# Altium project PWM_IO.PrjPcb
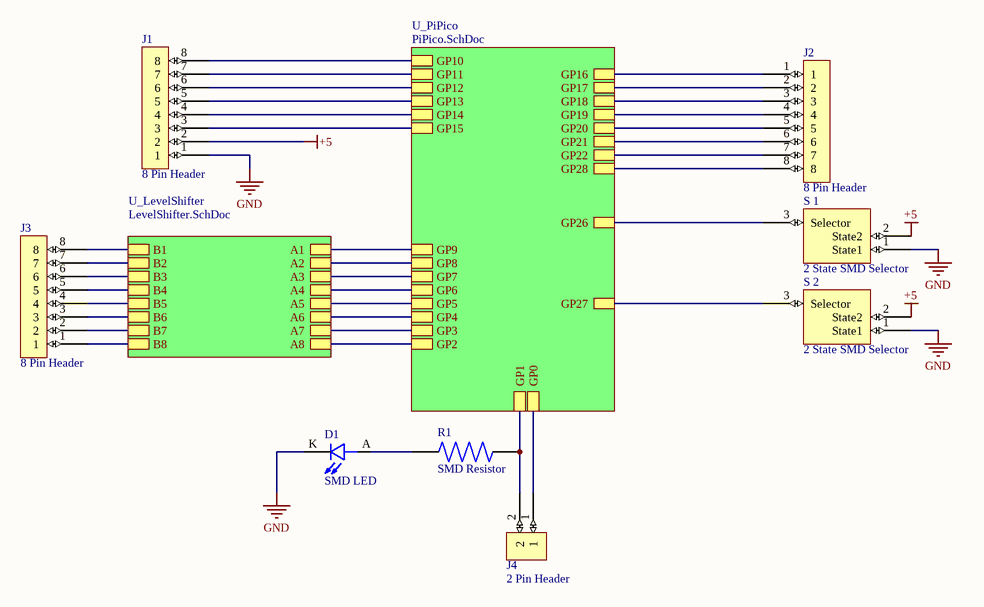
[diagram p0: TopLevel.SchDoc]
3 sheets, 16 parts. Net scope: hierarchical (ports join the sheet entries above them; power ports are global).
Board files: PWm_IO.PcbDoc, PWM Header Board.PcbDoc
Sheets:
  TopLevel.SchDoc
    U_PiPico = PiPico.SchDoc
    U_LevelShifter = LevelShifter.SchDoc

## Sheet TopLevel.SchDoc
size A4; SheetNumber: 1; SheetTotal: 3

### Parts
D1  SMD LED  [SMD LED-Footprint-1]
J1  8 Pin Header  [8 Pin Header-Footprint-1]
J2  8 Pin Header  [8 Pin Header-Footprint-1]
J3  8 Pin Header  [8 Pin Header-Footprint-1]
J4  2 Pin Header  [2 Pin Header-Footprint-1]
R1  SMD Resistor  [SMD Resistor-Footprint-1]
S_1  2 State SMD Selector  [2 State SMD Selector-Footprint-1]
S_2  2 State SMD Selector  [2 State SMD Selector-Footprint-1]

### Sub-sheets
U_LevelShifter = LevelShifter.SchDoc: A1, A2, A3, A4, B1, B2, B3, B4, A5, A6, A7, A8, B5, B6, B7, B8
U_PiPico = PiPico.SchDoc: GP0, GP1, GP2, GP3, GP4, GP5, GP6, GP7, GP8, GP9, GP10, GP11, GP12, GP13, GP14, GP15, GP16, GP17, GP18, GP19, GP20, GP21, GP22, GP26, GP27, GP28

### Nets
+5: J1.2 S_1.2(State2) S_2.2(State2)
GND: D1.K(C) J1.1 S_1.1(State1) S_2.1(State1)
NetD1_A: D1.A R1.1
NetI1_1: sheet U_PiPico/GP9, sheet U_LevelShifter/A1
NetI1_3: sheet U_PiPico/GP8, sheet U_LevelShifter/A2
NetI1_4: sheet U_PiPico/GP7, sheet U_LevelShifter/A3
NetI1_5: sheet U_PiPico/GP6, sheet U_LevelShifter/A4
NetI1_6: sheet U_PiPico/GP5, sheet U_LevelShifter/A5
NetI1_7: sheet U_PiPico/GP4, sheet U_LevelShifter/A6
NetI1_8: sheet U_PiPico/GP3, sheet U_LevelShifter/A7
NetI1_9: sheet U_PiPico/GP2, sheet U_LevelShifter/A8
NetI1_12: J3.1 ; sheet U_LevelShifter/B8
NetI1_13: J3.2 ; sheet U_LevelShifter/B7
NetI1_14: J3.3 ; sheet U_LevelShifter/B6
NetI1_15: J3.4 ; sheet U_LevelShifter/B5
NetI1_16: J3.5 ; sheet U_LevelShifter/B4
NetI1_17: J3.6 ; sheet U_LevelShifter/B3
NetI1_18: J3.7 ; sheet U_LevelShifter/B2
NetI1_20: J3.8 ; sheet U_LevelShifter/B1
NetJ1_3: J1.3 ; sheet U_PiPico/GP15
NetJ1_4: J1.4 ; sheet U_PiPico/GP14
NetJ1_5: J1.5 ; sheet U_PiPico/GP13
NetJ1_6: J1.6 ; sheet U_PiPico/GP12
NetJ1_7: J1.7 ; sheet U_PiPico/GP11
NetJ1_8: J1.8 ; sheet U_PiPico/GP10
NetJ2_1: J2.1 ; sheet U_PiPico/GP16
NetJ2_2: J2.2 ; sheet U_PiPico/GP17
NetJ2_3: J2.3 ; sheet U_PiPico/GP18
NetJ2_4: J2.4 ; sheet U_PiPico/GP19
NetJ2_5: J2.5 ; sheet U_PiPico/GP20
NetJ2_6: J2.6 ; sheet U_PiPico/GP21
NetJ2_7: J2.7 ; sheet U_PiPico/GP22
NetJ2_8: J2.8 ; sheet U_PiPico/GP28
NetJ4_1: J4.1 ; sheet U_PiPico/GP0
NetJ4_2: J4.2 R1.2 ; sheet U_PiPico/GP1
NetM1_31: S_1.3(Selector) ; sheet U_PiPico/GP26
NetM1_32: S_2.3(Selector) ; sheet U_PiPico/GP27

### Library data of the parts
D1 = CMP-00018-3: Generic SMD LED
J1-J3 = CMP-00039-1: 8 Pin Breakout Header
J4 = CMP-00041-1: 2Pin  Breakout Header
R1 = CMP-00019-2: Generic SMD Resistor
S_1 S_2 = CMP-00040-1: This is a SMD Pin Soldering Selector

## Sheet PiPico.SchDoc
size A4; SheetNumber: 2; SheetTotal: 3
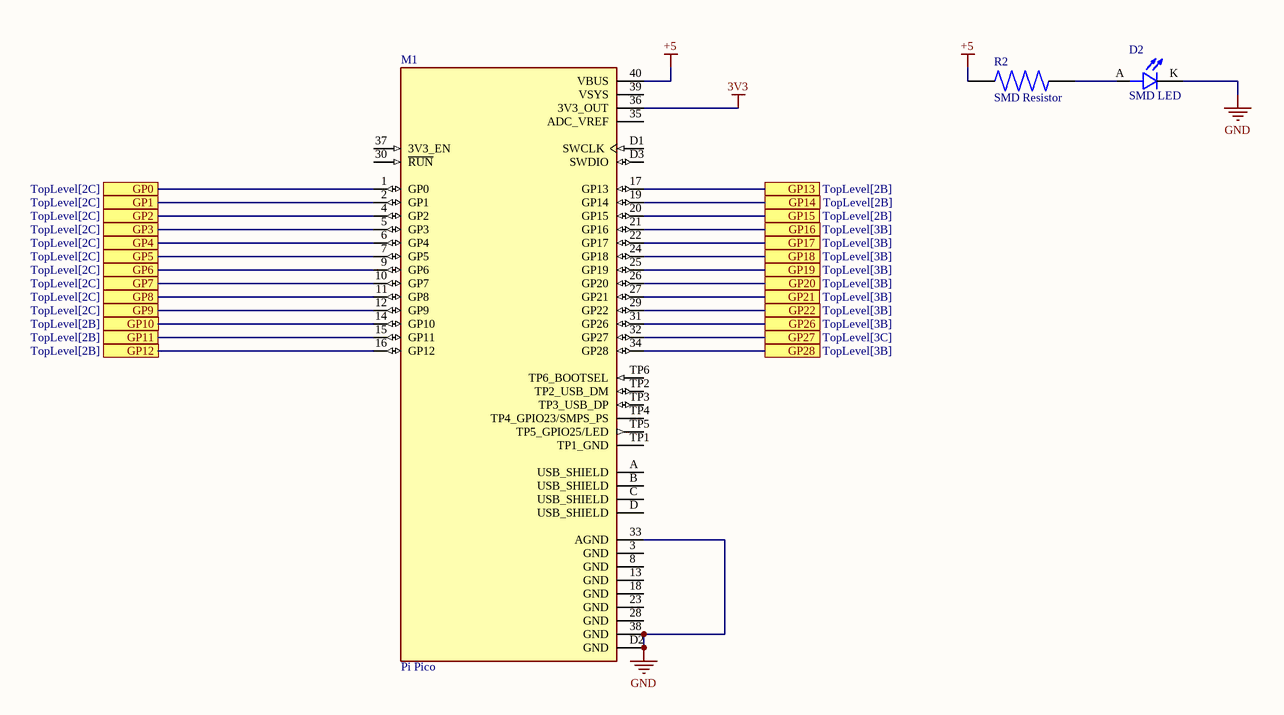
[diagram p1: PiPico.SchDoc]

### Parts
D2  SMD LED  [SMD LED-Footprint-1]
M1  Pi Pico  [Pi Pico-Footprint-1]
R2  SMD Resistor  [SMD Resistor-Footprint-1]

### Ports
GP0 (see TopLevel[2C]), GP1 (see TopLevel[2C]), GP2 (see TopLevel[2C]), GP3 (see TopLevel[2C]), GP4 (see TopLevel[2C]), GP5 (see TopLevel[2C]), GP6 (see TopLevel[2C]), GP7 (see TopLevel[2C]), GP8 (see TopLevel[2C]), GP9 (see TopLevel[2C]), GP10 (see TopLevel[2B]), GP11 (see TopLevel[2B]), GP12 (see TopLevel[2B]), GP13 (see TopLevel[2B]), GP14 (see TopLevel[2B]), GP15 (see TopLevel[2B]), GP16 (see TopLevel[3B]), GP17 (see TopLevel[3B]), GP18 (see TopLevel[3B]), GP19 (see TopLevel[3B]), GP20 (see TopLevel[3B]), GP21 (see TopLevel[3B]), GP22 (see TopLevel[3B]), GP26 (see TopLevel[3B]), GP27 (see TopLevel[3C]), GP28 (see TopLevel[3B])

### Nets
3V3: M1.36(3V3_OUT)
+5: M1.40(VBUS) R2.1
GND: D2.K(C) M1.33(AGND) M1.38(GND) M1.D2(GND)
NetD2_A: D2.A R2.2
NetI1_1: M1.12(GP9) ; port GP9
NetI1_3: M1.11(GP8) ; port GP8
NetI1_4: M1.10(GP7) ; port GP7
NetI1_5: M1.9(GP6) ; port GP6
NetI1_6: M1.7(GP5) ; port GP5
NetI1_7: M1.6(GP4) ; port GP4
NetI1_8: M1.5(GP3) ; port GP3
NetI1_9: M1.4(GP2) ; port GP2
NetJ1_3: M1.20(GP15) ; port GP15
NetJ1_4: M1.19(GP14) ; port GP14
NetJ1_5: M1.17(GP13) ; port GP13
NetJ1_6: M1.16(GP12) ; port GP12
NetJ1_7: M1.15(GP11) ; port GP11
NetJ1_8: M1.14(GP10) ; port GP10
NetJ2_1: M1.21(GP16) ; port GP16
NetJ2_2: M1.22(GP17) ; port GP17
NetJ2_3: M1.24(GP18) ; port GP18
NetJ2_4: M1.25(GP19) ; port GP19
NetJ2_5: M1.26(GP20) ; port GP20
NetJ2_6: M1.27(GP21) ; port GP21
NetJ2_7: M1.29(GP22) ; port GP22
NetJ2_8: M1.34(GP28) ; port GP28
NetJ4_1: M1.1(GP0) ; port GP0
NetJ4_2: M1.2(GP1) ; port GP1
NetM1_31: M1.31(GP26) ; port GP26
NetM1_32: M1.32(GP27) ; port GP27

Not connected (* = marked no-connect by the designer): M1 3(GND) 8(GND) 13(GND) 18(GND) 23(GND) 28(GND) 30(~{RUN}) 35(ADC_VREF) 37(3V3_EN) 39(VSYS) A(USB_SHIELD) B(USB_SHIELD) C(USB_SHIELD) D(USB_SHIELD) D1(SWCLK) D3(SWDIO) TP1(TP1_GND) TP2(TP2_USB_DM) TP3(TP3_USB_DP) TP4(TP4_GPIO23/SMPS_PS) TP5(TP5_GPIO25/LED) TP6(TP6_BOOTSEL)

### Library data of the parts
D2 = CMP-00018-3: Generic SMD LED
M1 = CMP-00035-2
R2 = CMP-00019-2: Generic SMD Resistor

## Sheet LevelShifter.SchDoc
size A4; SheetNumber: 3; SheetTotal: 3
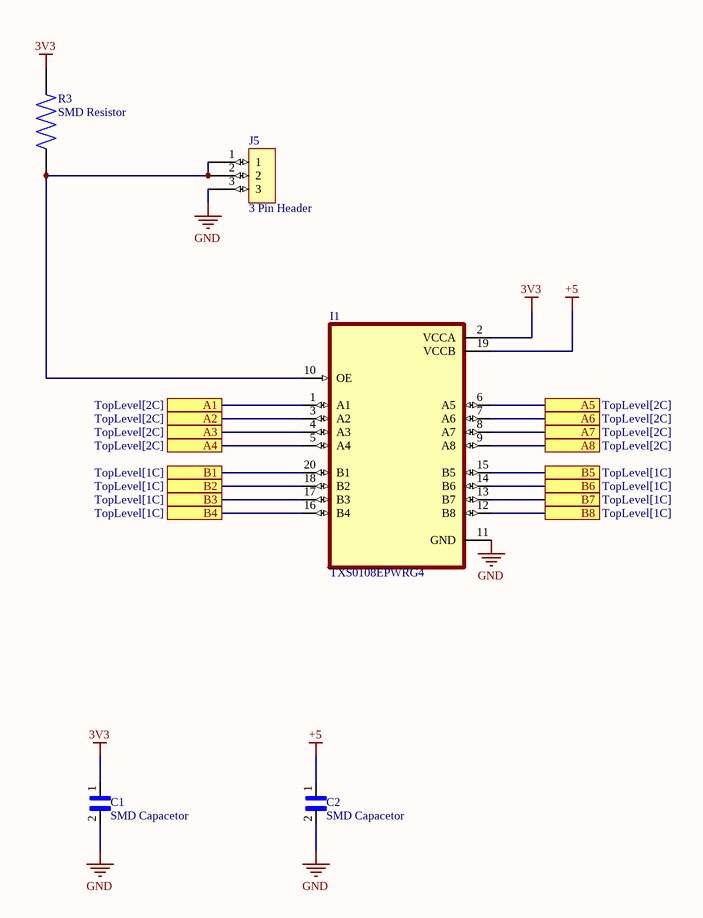
[diagram p2: LevelShifter.SchDoc]

### Parts
C1  SMD Capacetor  [SMD Capacetor-Footprint-1]
C2  SMD Capacetor  [SMD Capacetor-Footprint-1]
I1  TXS0108EPWRG4  [TXS0108EPWRG4-Footprint-1]
J5  3 Pin Header  [3 Pin Header-Footprint-1]
R3  SMD Resistor  [SMD Resistor-Footprint-1]

### Ports
A1 (see TopLevel[2C]), A2 (see TopLevel[2C]), A3 (see TopLevel[2C]), A4 (see TopLevel[2C]), A5 (see TopLevel[2C]), A6 (see TopLevel[2C]), A7 (see TopLevel[2C]), A8 (see TopLevel[2C]), B1 (see TopLevel[1C]), B2 (see TopLevel[1C]), B3 (see TopLevel[1C]), B4 (see TopLevel[1C]), B5 (see TopLevel[1C]), B6 (see TopLevel[1C]), B7 (see TopLevel[1C]), B8 (see TopLevel[1C])

### Nets
3V3: C1.1 I1.2(VCCA) R3.1
+5: C2.1 I1.19(VCCB)
GND: C1.2 C2.2 I1.11(GND) J5.3
NetI1_1: I1.1(A1) ; port A1
NetI1_3: I1.3(A2) ; port A2
NetI1_4: I1.4(A3) ; port A3
NetI1_5: I1.5(A4) ; port A4
NetI1_6: I1.6(A5) ; port A5
NetI1_7: I1.7(A6) ; port A6
NetI1_8: I1.8(A7) ; port A7
NetI1_9: I1.9(A8) ; port A8
NetI1_10: I1.10(OE) J5.1 J5.2 R3.2
NetI1_12: I1.12(B8) ; port B8
NetI1_13: I1.13(B7) ; port B7
NetI1_14: I1.14(B6) ; port B6
NetI1_15: I1.15(B5) ; port B5
NetI1_16: I1.16(B4) ; port B4
NetI1_17: I1.17(B3) ; port B3
NetI1_18: I1.18(B2) ; port B2
NetI1_20: I1.20(B1) ; port B1

### Library data of the parts
C1 C2 = CMP-00017-2: Generic SMD Capacetor
I1 = CMP-00042-2: 8-bit bidirectional voltage-level shifter
J5 = CMP-00043-1: 3 Pin Breakout Header
R3 = CMP-00019-2: Generic SMD Resistor

## Nets that join several sheets
3V3: PiPico (M1.36), LevelShifter (C1.1 I1.2 R3.1)
+5: TopLevel (J1.2 S_1.2 S_2.2), PiPico (M1.40 R2.1), LevelShifter (C2.1 I1.19)
GND: TopLevel (D1.K J1.1 S_1.1 S_2.1), PiPico (D2.K M1.33 M1.38 M1.D2), LevelShifter (C1.2 C2.2 I1.11 J5.3)
NetI1_1: PiPico (M1.12), LevelShifter (I1.1)
NetI1_3: PiPico (M1.11), LevelShifter (I1.3)
NetI1_4: PiPico (M1.10), LevelShifter (I1.4)
NetI1_5: PiPico (M1.9), LevelShifter (I1.5)
NetI1_6: PiPico (M1.7), LevelShifter (I1.6)
NetI1_7: PiPico (M1.6), LevelShifter (I1.7)
NetI1_8: PiPico (M1.5), LevelShifter (I1.8)
NetI1_9: PiPico (M1.4), LevelShifter (I1.9)
NetI1_12: TopLevel (J3.1), LevelShifter (I1.12)
NetI1_13: TopLevel (J3.2), LevelShifter (I1.13)
NetI1_14: TopLevel (J3.3), LevelShifter (I1.14)
NetI1_15: TopLevel (J3.4), LevelShifter (I1.15)
NetI1_16: TopLevel (J3.5), LevelShifter (I1.16)
NetI1_17: TopLevel (J3.6), LevelShifter (I1.17)
NetI1_18: TopLevel (J3.7), LevelShifter (I1.18)
NetI1_20: TopLevel (J3.8), LevelShifter (I1.20)
NetJ1_3: TopLevel (J1.3), PiPico (M1.20)
NetJ1_4: TopLevel (J1.4), PiPico (M1.19)
NetJ1_5: TopLevel (J1.5), PiPico (M1.17)
NetJ1_6: TopLevel (J1.6), PiPico (M1.16)
NetJ1_7: TopLevel (J1.7), PiPico (M1.15)
NetJ1_8: TopLevel (J1.8), PiPico (M1.14)
NetJ2_1: TopLevel (J2.1), PiPico (M1.21)
NetJ2_2: TopLevel (J2.2), PiPico (M1.22)
NetJ2_3: TopLevel (J2.3), PiPico (M1.24)
NetJ2_4: TopLevel (J2.4), PiPico (M1.25)
NetJ2_5: TopLevel (J2.5), PiPico (M1.26)
NetJ2_6: TopLevel (J2.6), PiPico (M1.27)
NetJ2_7: TopLevel (J2.7), PiPico (M1.29)
NetJ2_8: TopLevel (J2.8), PiPico (M1.34)
NetJ4_1: TopLevel (J4.1), PiPico (M1.1)
NetJ4_2: TopLevel (J4.2 R1.2), PiPico (M1.2)
NetM1_31: TopLevel (S_1.3), PiPico (M1.31)
NetM1_32: TopLevel (S_2.3), PiPico (M1.32)